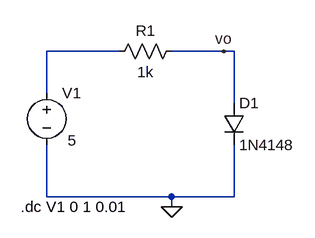
[diagram p0: schematic PN Junction.asc]
PN Junction.asc, the LTspice schematic file:
Version 4
SHEET 1 880 680
WIRE 432 256 320 256
WIRE 592 256 512 256
WIRE 608 256 592 256
WIRE 320 320 320 256
WIRE 608 336 608 256
WIRE 320 480 320 400
WIRE 512 480 320 480
WIRE 608 480 608 400
WIRE 608 480 512 480
WIRE 512 496 512 480
FLAG 512 496 0
FLAG 592 256 vo
SYMBOL voltage 320 304 R0
WINDOW 3 32 89 Left 2
SYMATTR InstName V1
SYMATTR Value 5
SYMBOL diode 592 336 R0
SYMATTR InstName D1
SYMATTR Value 1N4148
SYMBOL res 528 240 R90
WINDOW 0 0 56 VBottom 2
WINDOW 3 32 56 VTop 2
SYMATTR InstName R1
SYMATTR Value 1k
TEXT 280 496 Left 2 !.dc V1 0 1 0.01

The netlist it stands for:
* PN Junction.asc
V1 N001 0 5
D1 vo 0 1N4148
R1 vo N001 1k
.model D D
.lib standard.dio
.dc V1 0 1 0.01
.backanno
.end